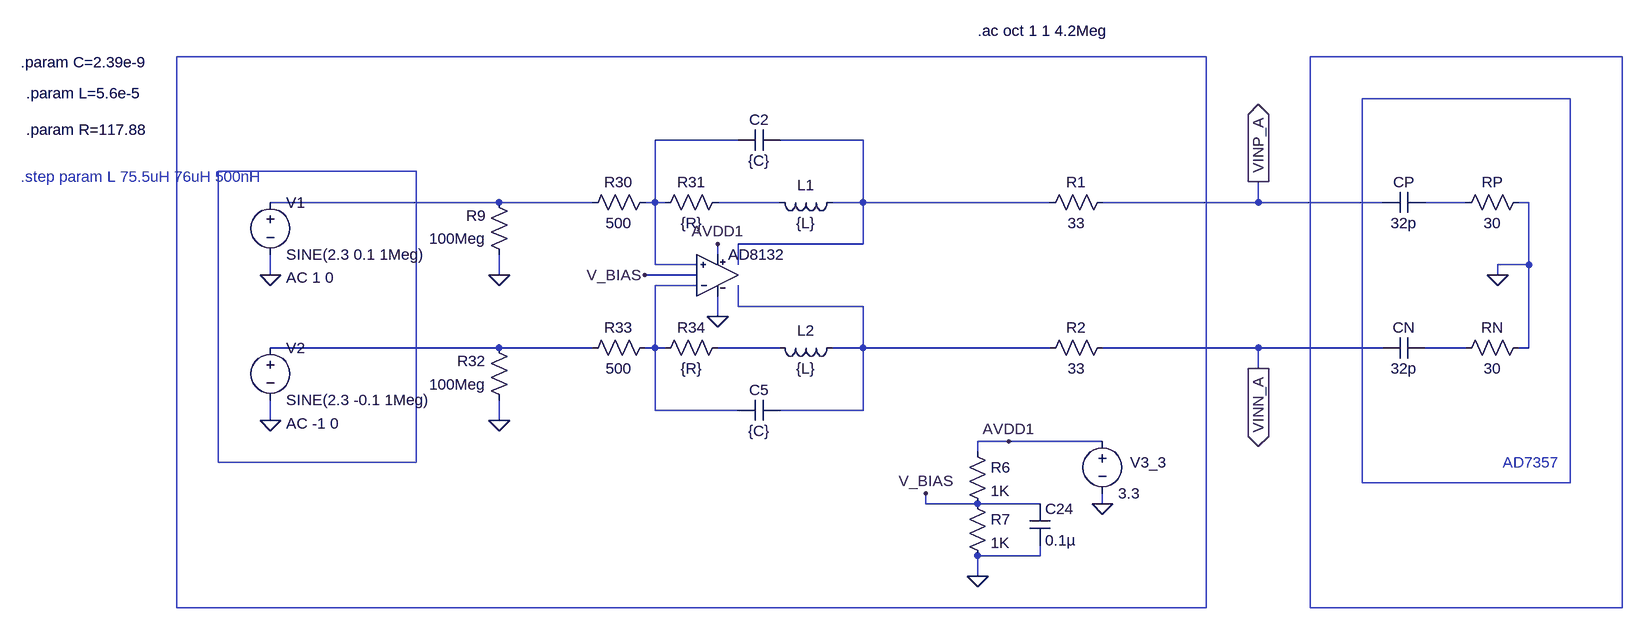
[diagram p0: schematic AD-AD8132-3.asc]
AD-AD8132-3.asc, the LTspice schematic file:
Version 4
SHEET 1 1456 680
WIRE -208 -48 -336 -48
WIRE -16 -48 -144 -48
WIRE -576 48 -928 48
WIRE -432 48 -576 48
WIRE -336 48 -336 -48
WIRE -336 48 -352 48
WIRE -320 48 -336 48
WIRE -144 48 -240 48
WIRE -16 48 -16 -48
WIRE -16 48 -64 48
WIRE 272 48 -16 48
WIRE 592 48 592 16
WIRE 592 48 352 48
WIRE 784 48 592 48
WIRE 912 48 848 48
WIRE 1008 48 992 48
WIRE -16 112 -16 48
WIRE -16 112 -208 112
WIRE -240 128 -240 112
WIRE -336 144 -336 48
WIRE -272 144 -336 144
WIRE -208 144 -208 112
WIRE 1008 144 1008 48
WIRE 1008 144 960 144
WIRE -928 160 -928 128
WIRE -576 160 -576 128
WIRE -272 160 -352 160
WIRE 960 160 960 144
WIRE -272 176 -336 176
WIRE -208 208 -208 176
WIRE -16 208 -208 208
WIRE -240 224 -240 192
WIRE -576 272 -928 272
WIRE -432 272 -576 272
WIRE -336 272 -336 176
WIRE -336 272 -352 272
WIRE -320 272 -336 272
WIRE -144 272 -240 272
WIRE -16 272 -16 208
WIRE -16 272 -64 272
WIRE 272 272 -16 272
WIRE 592 272 352 272
WIRE 784 272 592 272
WIRE 912 272 848 272
WIRE 1008 272 1008 144
WIRE 1008 272 992 272
WIRE 592 304 592 272
WIRE -336 368 -336 272
WIRE -208 368 -336 368
WIRE -16 368 -16 272
WIRE -16 368 -144 368
WIRE -928 384 -928 352
WIRE -576 384 -576 352
WIRE 208 416 160 416
WIRE 352 416 208 416
WIRE 160 432 160 416
WIRE 80 512 80 496
WIRE 160 512 80 512
WIRE 256 512 160 512
WIRE 352 512 352 496
WIRE 256 592 256 576
WIRE 256 592 160 592
WIRE 160 624 160 592
FLAG -576 160 0
FLAG -576 384 0
FLAG 592 304 VINN_A
IOPIN 592 304 Out
FLAG 592 16 VINP_A
IOPIN 592 16 Out
FLAG -928 160 0
FLAG 208 416 AVDD1
FLAG 352 512 0
FLAG -240 112 AVDD1
FLAG -240 224 0
FLAG 160 624 0
FLAG 80 496 V_BIAS
FLAG -352 160 V_BIAS
FLAG 960 160 0
FLAG -928 384 0
SYMBOL res -336 256 R90
WINDOW 0 0 56 VBottom 0
WINDOW 3 32 56 VTop 0
SYMATTR InstName R33
SYMATTR Value 500
SYMATTR SpiceLine tol=1 pwr=0.1
SYMBOL res -336 32 R90
WINDOW 0 0 56 VBottom 0
WINDOW 3 32 56 VTop 0
SYMATTR InstName R30
SYMATTR Value 500
SYMATTR SpiceLine tol=1 pwr=0.1
SYMBOL res -560 368 R180
WINDOW 0 36 76 Left 0
WINDOW 3 36 40 Left 0
SYMATTR InstName R32
SYMATTR Value 100Meg
SYMATTR SpiceLine tol=1 pwr=0.1
SYMBOL res -560 144 R180
WINDOW 0 36 76 Left 0
WINDOW 3 36 40 Left 0
SYMATTR InstName R9
SYMATTR Value 100Meg
SYMATTR SpiceLine tol=1 pwr=0.1
SYMBOL res -224 256 R90
WINDOW 0 0 56 VBottom 0
WINDOW 3 32 56 VTop 0
SYMATTR InstName R34
SYMATTR Value {R}
SYMATTR SpiceLine tol=1 pwr=0.1
SYMBOL res -224 32 R90
WINDOW 0 0 56 VBottom 0
WINDOW 3 32 56 VTop 0
SYMATTR InstName R31
SYMATTR Value {R}
SYMATTR SpiceLine tol=1 pwr=0.1
SYMBOL cap 848 32 R90
WINDOW 0 0 32 VBottom 0
WINDOW 3 32 32 VTop 0
SYMATTR InstName CP
SYMATTR Value 32p
SYMBOL res 896 288 R270
WINDOW 0 32 56 VTop 0
WINDOW 3 0 56 VBottom 0
SYMATTR InstName RN
SYMATTR Value 30
SYMATTR SpiceLine tol=1 pwr=0.1
SYMBOL cap 848 256 R90
WINDOW 0 0 32 VBottom 0
WINDOW 3 32 32 VTop 0
SYMATTR InstName CN
SYMATTR Value 32p
SYMBOL voltage -928 32 R0
WINDOW 123 24 132 Left 0
WINDOW 39 24 132 Left 0
SYMATTR Value2 AC 1 0
SYMATTR InstName V1
SYMATTR Value SINE(2.3 0.1 1Meg)
SYMBOL voltage 352 400 R0
WINDOW 123 0 0 Left 0
WINDOW 39 0 0 Left 0
WINDOW 0 43 48 Left 0
SYMATTR InstName V3_3
SYMATTR Value 3.3
SYMBOL ad8132 -240 160 R0
SYMATTR InstName AD8132
SYMBOL res 144 416 R0
SYMATTR InstName R6
SYMATTR Value 1K
SYMATTR SpiceLine tol=1 pwr=0.1
SYMBOL res 144 496 R0
SYMATTR InstName R7
SYMATTR Value 1K
SYMATTR SpiceLine tol=1 pwr=0.1
SYMBOL cap 240 512 R0
SYMATTR InstName C24
SYMATTR Value 0.1µ
SYMBOL res 1008 32 R90
WINDOW 0 0 56 VBottom 0
WINDOW 3 32 56 VTop 0
SYMATTR InstName RP
SYMATTR Value 30
SYMBOL voltage -928 256 R0
WINDOW 123 24 132 Left 0
WINDOW 39 24 132 Left 0
SYMATTR Value2 AC -1 0
SYMATTR InstName V2
SYMATTR Value SINE(2.3 -0.1 1Meg)
SYMBOL res 368 32 R90
WINDOW 0 0 56 VBottom 0
WINDOW 3 32 56 VTop 0
SYMATTR InstName R1
SYMATTR Value 33
SYMBOL res 368 256 R90
WINDOW 0 0 56 VBottom 0
WINDOW 3 32 56 VTop 0
SYMATTR InstName R2
SYMATTR Value 33
SYMBOL cap -144 -64 R90
WINDOW 0 0 32 VBottom 0
WINDOW 3 32 32 VTop 0
SYMATTR InstName C2
SYMATTR Value {C}
SYMBOL cap -144 384 M270
WINDOW 0 32 32 VTop 0
WINDOW 3 0 32 VBottom 0
SYMATTR InstName C5
SYMATTR Value {C}
SYMBOL ind -48 32 R90
WINDOW 0 5 56 VBottom 0
WINDOW 3 32 56 VTop 0
SYMATTR InstName L1
SYMATTR Value {L}
SYMBOL ind -48 256 R90
WINDOW 0 5 56 VBottom 0
WINDOW 3 32 56 VTop 0
SYMATTR InstName L2
SYMATTR Value {L}
TEXT 160 -216 Left 0 !.ac oct 1 1 4.2Meg
TEXT 968 448 Left 0 ;AD7357
TEXT -1312 -168 Left 0 !.param C=2.39e-9
TEXT -1312 8 Left 0 ;.step param L 75.5uH 76uH 500nH
TEXT -1304 -120 Left 0 !.param L=5.6e-5
TEXT -1304 -64 Left 0 !.param R=117.88
RECTANGLE Normal 752 480 1072 -112
RECTANGLE Normal -1008 448 -704 0
RECTANGLE Normal -1072 672 512 -176
RECTANGLE Normal 1152 672 672 -176

The netlist it stands for:
* AD-AD8132-3.asc
R33 N006 N008 500 tol=1 pwr=0.1
R30 N001 N003 500 tol=1 pwr=0.1
R32 0 N008 100Meg tol=1 pwr=0.1
R9 0 N003 100Meg tol=1 pwr=0.1
R34 N009 N006 {R} tol=1 pwr=0.1
R31 N004 N001 {R} tol=1 pwr=0.1
CP N005 VINP_A 32p
RN N010 0 30 tol=1 pwr=0.1
CN N010 VINN_A 32p
V1 N003 0 SINE(2.3 0.1 1Meg) AC 1 0
V3_3 AVDD1 0 3.3
XAD8132 N001 N006 AVDD1 0 N002 N007 V_BIAS AD8132  ; pins In+ In- V+ V- OUT- OUT+ VOCM
R6 AVDD1 V_BIAS 1K tol=1 pwr=0.1
R7 V_BIAS 0 1K tol=1 pwr=0.1
C24 V_BIAS 0 0.1µ
RP 0 N005 30
V2 N008 0 SINE(2.3 -0.1 1Meg) AC -1 0
R1 VINP_A N002 33
R2 VINN_A N007 33
C2 N002 N001 {C}
C5 N007 N006 {C}
L1 N002 N004 {L}
L2 N007 N009 {L}
.ac oct 1 1 4.2Meg
* AD7357
.param C=2.39e-9
* .step param L 75.5uH 76uH 500nH
.param L=5.6e-5
.param R=117.88
.lib ad8132.cir
.backanno
.end